# Altium schematic sheet EEL3111C Lab 10 Schematic.SchDoc
size A; SheetNumber: 1; SheetTotal: 1
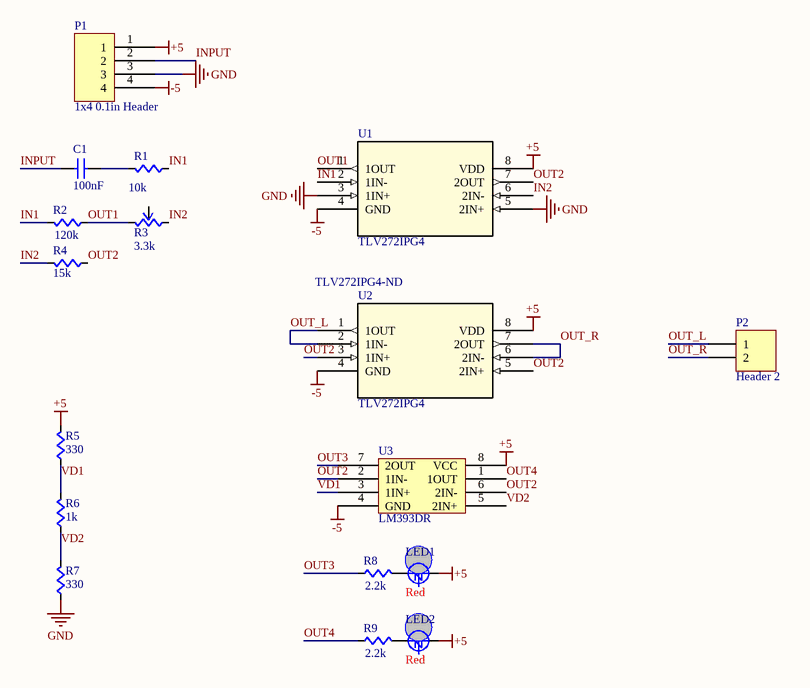
[diagram p0: EEL3111C Lab 10 Schematic.SchDoc]

## Parts
C1  value 100nF  [CAPC0603]  (hidden comment: Cap)
LED1  Color: Red  [LED0603]  (hidden comment: LED)
LED2  Color: Red  [LED0603]  (hidden comment: LED)
P1  1x4 0.1in Header  [1x4 0.1in Header]
P2  Header 2  [HDR1X2]
R1  value 10k  [RES0603]  (hidden comment: Res)
R2  value 120k  [RES0603]  (hidden comment: Res)
R3  value 3.3k  [ST4ETA103]  (hidden comment: Pot)
R4  value 15k  [RES0603]  (hidden comment: Res)
R5  value 330  [RES0603]  (hidden comment: Res)
R6  value 1k  [RES0603]  (hidden comment: Res)
R7  value 330  [RES0603]  (hidden comment: Res)
R8  value 2.2k  [RES0603]  (hidden comment: Res)
R9  value 2.2k  [RES0603]  (hidden comment: Res)
U1  TLV272IPG4  [P8_TEX]
U2  TLV272IPG4  Supplier Part Number 1: TLV272IPG4-ND  [P8_TEX]
U3  LM393DR  [LM393DR]

## Nets
+5: LED1.A LED2.A P1.1 R5.1(A) U1.8(VDD) U2.8(VDD) U3.8(VCC)
-5: P1.4 U1.4(GND) U2.4(GND) U3.4(GND)
GND: P1.3 R7.2(B) U1.3(1IN+) U1.5(2IN+)
IN1: R1.2(B) R2.1(A) U1.2(1IN-)
IN2: R3.2 R4.1(A) U1.6(2IN-)
INPUT: C1.1(A) P1.2
OUT1: R2.2(B) R3.1 U1.1(1OUT)
OUT2: R4.2(B) U1.7(2OUT) U2.3(1IN+) U2.5(2IN+) U3.2(1IN-) U3.6(2IN-)
OUT3: R8.2(B) U3.7(2OUT)
OUT4: R9.2(B) U3.1(1OUT)
OUT_L: P2.1 U2.1(1OUT) U2.2(1IN-)
OUT_R: P2.2 U2.6(2IN-) U2.7(2OUT)
VD1: R5.2(B) R6.1(A) U3.3(1IN+)
VD2: R6.2(B) R7.1(A) U3.5(2IN+)
NetC1_2: C1.2(B) R1.1(A)
NetLED1_C: LED1.C R8.1(A)
NetLED2_C: LED2.C R9.1(A)

Not connected (* = marked no-connect by the designer): R3 3

## Library data of the parts
P2 = Header 2: Header, 2-Pin; LatestRevisionDate: 17-Jul-2002; LatestRevisionNote: Re-released for DXP Platform.; Publisher: Altium Limited
R3 = Potentiometer: Supplier 1: Digi-Key; Supplier Part Number 1: ST4ETA103CT-ND
U1 U2 = TLV272IPG4: No Description Available; Mfr_Name: Texas Instruments; Copyright: Copyright (C) 2021 Ultra Librarian. All rights reserved.; Manufacturer_Part_Number: TLV272IPG4; Digi-Key_Part_Number_1: TLV272IPG4-ND; Digi-Key_Part_Number_2: 296-12671-5-ND; RefDes: RefDes; Type: DEV
  U2: Supplier 1: Digi-Key
U3 = LM393DR: LM393DR Comparator; Supplier 1: Digi-key; Supplier Part Number 1: 296-1015-1-ND
C1 = Cap: Supplier 1: Digi-Key; Supplier Part Number 1: 1276-1000-1-ND
LED1 LED2 = LED: Supplier 1: Digi-Key; Supplier Part Number 1: 754-1122-1-ND
R1 R2 R4-R9 = Res: Supplier 1: Digi-Key; Supplier Part Number 1: RMCF0603JT10K0CT-ND